# EasyEDA schematic SCH_Esp12_Power_Module_2022-09-06.json
TITLE: Sheet_1; REV: 1.0; Date: 2022-03-10; Sheet: 1/1; Drawn By: MaxSoloAT
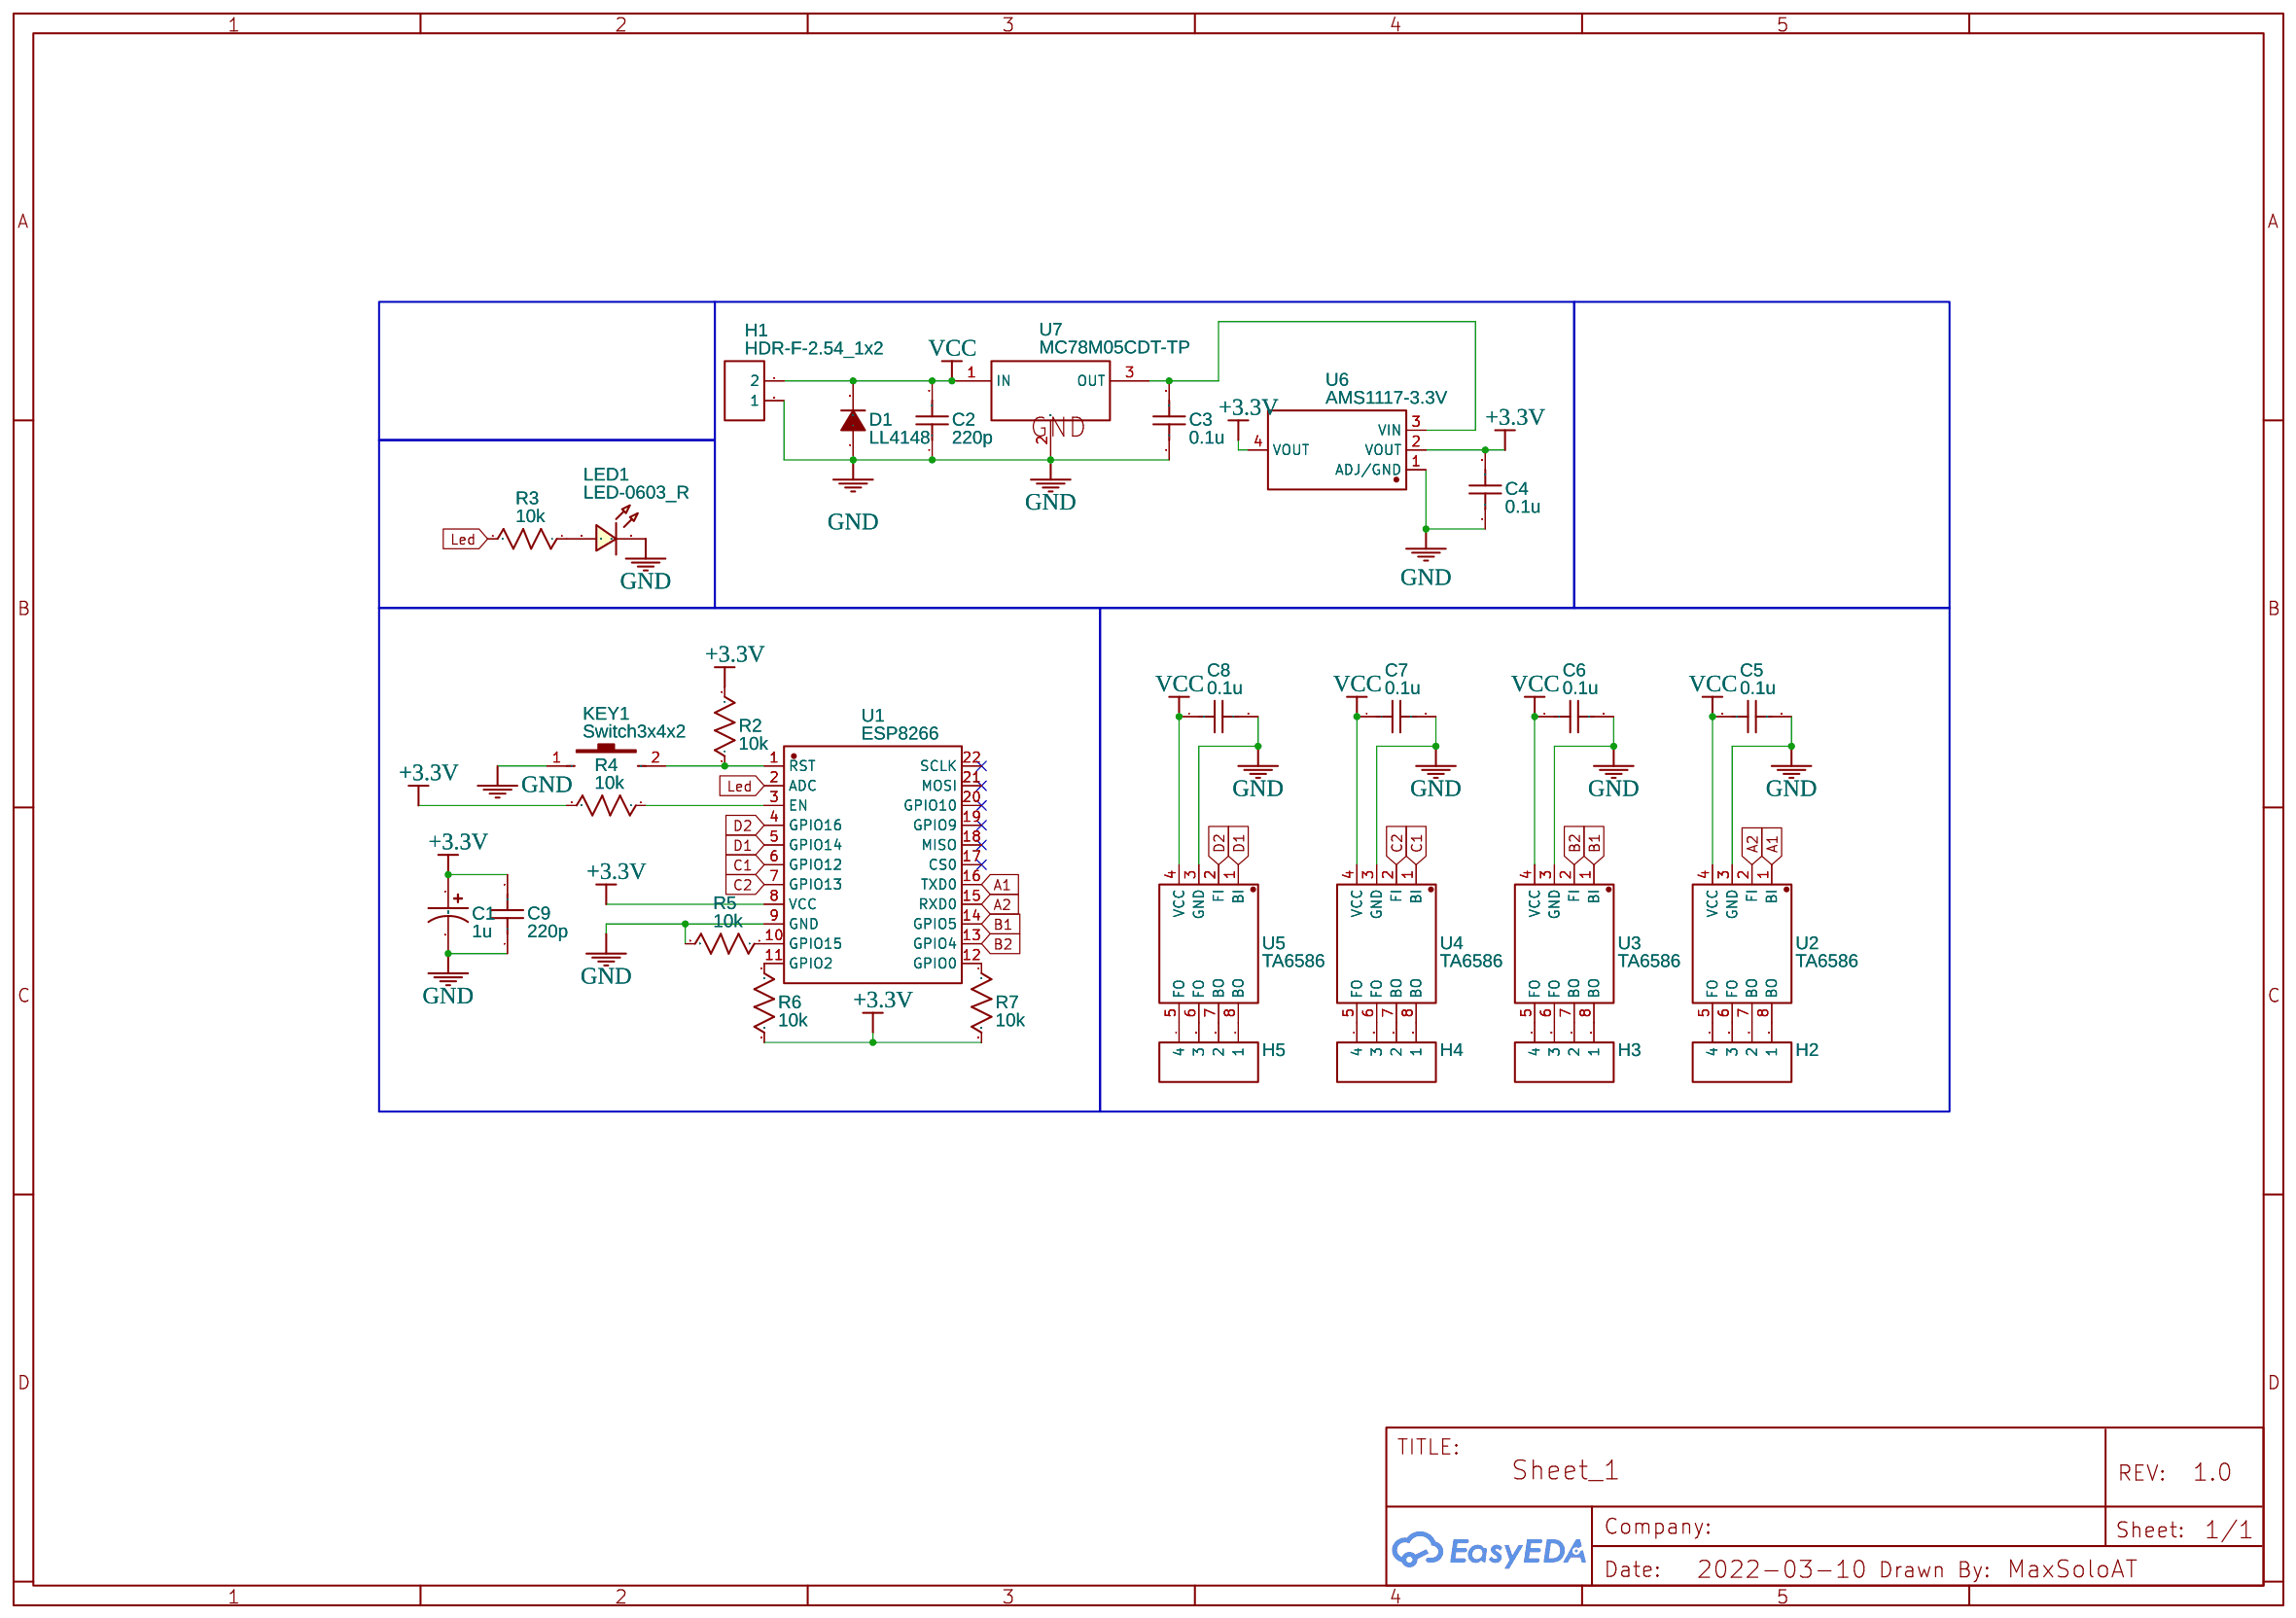
[diagram p0: schematic sheet]

## Parts
C1  1u  [CASE-B_3528]
C2  220p  [C0603]
C3  0.1u  [C0603]
C4  0.1u  [C0603]
C5  0.1u  [C0603]
C6  0.1u  [C0603]
C7  0.1u  [C0603]
C8  0.1u  [C0603]
C9  220p  [C0603]
D1  LL4148  [LL-34_L3.5-W1.5-RD-1]
H1  HDR-F-2.54_1x2  [HDR-F-2.54_1X2]
H2  HDR-F-2.54_1x4  [HDR-F-2.54_1X4]
H3  HDR-F-2.54_1x4  [HDR-F-2.54_1X4]
H4  HDR-F-2.54_1x4  [HDR-F-2.54_1X4]
H5  HDR-F-2.54_1x4  [HDR-F-2.54_1X4]
KEY1  Switch3x4x2  [SW-SMD_L4.0-W2.9-LS5.0]
LED1  LED-0603_R  [LED0603_RED]
R2  10k  [R0603]
R3  10k  [R0603]
R4  10k  [R0603]
R5  10k  [R0603]
R6  10k  [R0603]
R7  10k  [R0603]
U1  ESP8266  [WIFIM-SMD_ESP-12F-ESP8266MOD]
U2  TA6586  [DIP-8_L10.0-W6.5-P2.54-LS7.6-BL]
U3  TA6586  [DIP-8_L10.0-W6.5-P2.54-LS7.6-BL]
U4  TA6586  [DIP-8_L10.0-W6.5-P2.54-LS7.6-BL]
U5  TA6586  [DIP-8_L10.0-W6.5-P2.54-LS7.6-BL]
U6  AMS1117-3.3V  [SOT-223-4_L6.5-W3.5-P2.30-LS7.0-BR]
U7  MC78M05CDT-TP  [TO-252-2_L6.6-W6.1-P4.57-LS10.1-BR]

## Library data of the parts
C1 = C_Tan_SMD_B_US: Contributor: LCEDA_Lib
C2-C9 = C_0603_US: Contributor: LCEDA_Lib
D1 = LL4148: Supplier: LCSC; Manufacturer: SEMTECH; Supplier Part: C9808; JLCPCB Part Class: Basic Part
H1 = HDR-F-2.54_1x2: Supplier Part: C49661; Supplier: LCSC; Contributor: LCEDA_Lib
H2-H5 = HDR-F-2.54_1x4: Supplier Part: C225501; Supplier: LCSC; Contributor: LCEDA_Lib
KEY1 = Switch3x4x2: Supplier: LCSC; Manufacturer: ReliaPro; Supplier Part: C26638; JLCPCB Part Class: Extended Part
LED1 = LED-0603_R: Manufacturer: EVERLIGHT(台湾亿光); Manufacturer Part: 19-217/R6C-AL1M2VY/3T; Supplier Part: C72044; Supplier: LCSC; Contributor: LCEDA_01
R2-R7 = R_0603_US: Contributor: LCEDA_Lib
U1 = ESP8266: Supplier: LCSC; Supplier Part: C9900003049; Manufacturer: null; JLCPCB Part Class: Extended Part; LINK: https://img.jlc.com/image//data/smt-stock-produce/componentSizePhoto/2021-12-02/b5eb61357b2a478295008aee8c894ebd/BG2111290693_D21112900056_font.png; Contributor: LCSC
U2-U5 = TA6586: Supplier: LCSC; Supplier Part: C128851; Manufacturer: Wuxi Smart Microelectronics; Contributor: LCSC; JLCPCB Part Class: Extended Part
U6 = AMS1117-3.3V: Supplier: LCSC; Supplier Part: C2688239; Manufacturer: WPMtek(维攀微); Contributor: LCSC; JLCPCB Part Class: Extended Part
U7 = MC78M05CDT-TP: Supplier: LCSC; Supplier Part: C194250; Manufacturer: MCC(美微科); Contributor: LCSC; JLCPCB Part Class: Extended Part

## Nets
+3.3V: C1.1 C4.2 C9.2 R2.2 R4.2 R6.2 R7.2 U1.8(VCC) U6.2(VOUT) U6.4(VOUT)
GND: C1.2 C2.1 C3.1 C4.1 C5.2 C6.2 C7.2 C8.2 C9.1 D1.1(A) H1.1 KEY1.1 LED1.2 R5.2 U1.9(GND) U2.3(GND) U3.3(GND) U4.3(GND) U5.3(GND) U6.1(ADJ/GND) U7.2(GND)
VCC: C2.2 C5.1 C6.1 C7.1 C8.1 D1.2(K) H1.2 U2.4(VCC) U3.4(VCC) U4.4(VCC) U5.4(VCC) U7.1(IN)
A1: U1.16(TXD0) U2.1(BI)
A2: U1.15(RXD0) U2.2(FI)
B1: U1.14(GPIO5) U3.1(BI)
B2: U1.13(GPIO4) U3.2(FI)
C1: U1.6(GPIO12) U4.1(BI)
C2: U1.7(GPIO13) U4.2(FI)
D1: U1.5(GPIO14) U5.1(BI)
D2: U1.4(GPIO16) U5.2(FI)
Led: R3.2 U1.2(ADC)
Net-(C3-2): C3.2 U6.3(VIN) U7.3(OUT)
Net-(H2-1): H2.1 U2.8(BO)
Net-(H2-2): H2.2 U2.7(BO)
Net-(H2-3): H2.3 U2.6(FO)
Net-(H2-4): H2.4 U2.5(FO)
Net-(H3-1): H3.1 U3.8(BO)
Net-(H3-2): H3.2 U3.7(BO)
Net-(H3-3): H3.3 U3.6(FO)
Net-(H3-4): H3.4 U3.5(FO)
Net-(H4-1): H4.1 U4.8(BO)
Net-(H4-2): H4.2 U4.7(BO)
Net-(H4-3): H4.3 U4.6(FO)
Net-(H4-4): H4.4 U4.5(FO)
Net-(H5-1): H5.1 U5.8(BO)
Net-(H5-2): H5.2 U5.7(BO)
Net-(H5-3): H5.3 U5.6(FO)
Net-(H5-4): H5.4 U5.5(FO)
Net-(KEY1-2): KEY1.2 R2.1 U1.1(RST)
Net-(LED1-1): LED1.1 R3.1
Net-(R4-1): R4.1 U1.3(EN)
Net-(R5-1): R5.1 U1.10(GPIO15)
Net-(R6-1): R6.1 U1.11(GPIO2)
Net-(R7-1): R7.1 U1.12(GPIO0)

Not connected (* = marked no-connect by the designer): U1 17(CS0)* 18(MISO)* 19(GPIO9)* 20(GPIO10)* 21(MOSI)* 22(SCLK)*
